# Altium schematic sheet 0603WAF499JT5E1_0603WAF499JT5E.schdoc
size 127 x 99 mm
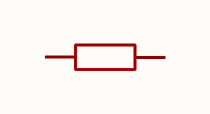
[diagram p0: 0603WAF499JT5E1_0603WAF499JT5E.schdoc]

## Parts
R?  49.9Ω  [R0603]  (value not drawn)

## Nets

Not connected (* = marked no-connect by the designer): R? 1 2

## Library data of the parts
R? = 0603WAF499JT5E: Manufacturer: UNI-ROYAL(厚声); Add into BOM: yes; Tolerance: ±1%; Power(Watts): 100mW; Voltage-Supply(Max): 75V; Temperature Coefficient: ±100ppm/℃; Symbol: 0603WAF499JT5E; Device: 0603WAF499JT5E; LCSC Part Name: 49.9Ω ±1% 100mW 厚膜电阻; Supplier Part: C23185; Manufacturer Part: 0603WAF499JT5E; Supplier Footprint: 0603; JLCPCB Part Class: Basic Part; Datasheet: https://item.szlcsc.com/datasheet/0603WAF499JT5E/23912.html; Supplier: LCSC; Convert to PCB: yes; Type: 厚膜电阻; Value: 49.9Ω; Operating Temperature: -55℃~+155℃